# EAGLE schematic harjapiirilevy (EAGLE 9.6.2)
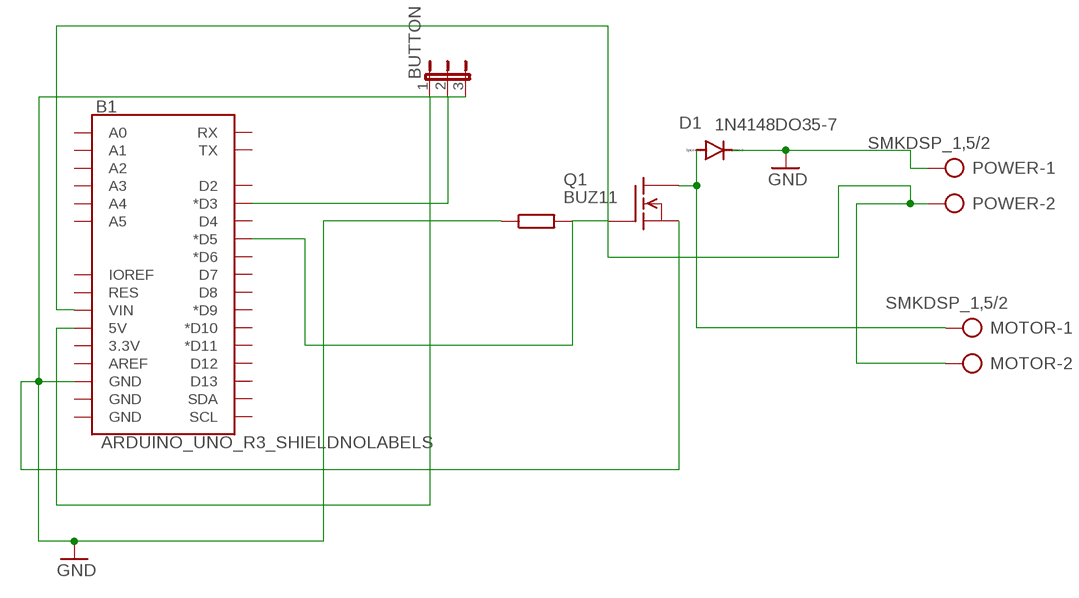
[diagram p0: schematic, sheet 1]

## Parts
B1  ARDUINO_UNO_R3_SHIELDNOLABELS  [UNO_R3_SHIELD_NOLABELS]
BUTTON  JP2E  [JP2]
D1  1N4148DO35-7  [DO35-7]
MOTOR  SMKDSP_1,5/2  [SMKDSP_1,5/2]
POWER  SMKDSP_1,5/2  [SMKDSP_1,5/2]
Q1  BUZ11  [TO220]

## Nets
GND: B1.GND@2(GND) BUTTON.3 D1.C POWER.1 Q1.3(S)
N$1: B1.5V BUTTON.1
N$2: B1.D3(*D3) BUTTON.2
N$4: B1.D5(*D5) Q1.1(G)
N$5: D1.A MOTOR.1 Q1.2(D)
N$7: B1.VIN MOTOR.2 POWER.2
Unconnected: B1.3.3V B1.A0 B1.A1 B1.A2 B1.A3 B1.A4 B1.A5 B1.AREF B1.D2 B1.D4 B1.D6(*D6) B1.D7 B1.D8 B1.D9(*D9) B1.D10(*D10) B1.D11(*D11) B1.D12 B1.D13 B1.GND@0(GND) B1.GND@1(GND) B1.IOREF B1.RES B1.RX B1.SCL B1.SDA B1.TX

## Library data of the parts
B1 = SparkFun-Boards:ARDUINO_UNO_R3_SHIELD: Arduino R3 Shield Footprint Shield form compatible with the Arduino Uno R3. SparkFun Products: MG2639 Cellular Shield <https://www.sparkfun.com/products/13120> MIDI Shield <https://www.sparkfun.com/products/12898> R3 Stackable Headers Kit <https://www.sparkfun.com/products/11417>
BUTTON = jumper:JP2E: JUMPER
D1 = diode:1N4148: DIODE high speed (Philips)
MOTOR POWER = con-phoenix-smkdsp:SMKDSP_1,5/2: Printklemme, Nennstrom: 17,5 A, Bemessungsspannung: 250 V, Raster: 5,0 mm Source: http://eshop.phoenixcontact.de .. 1733415.pdf; MF: FARNELL; MPN: 1733570; OC_FARNELL: 3041244; OC_NEWARK: 69C8588
Q1 = transistor-fet:BUZ11: N-Channel Enhancement MOSFET 50V; 30A; 0,040Ohm

## Net classes
0 default: width 1 mm, drill 1 mm, clearance 1 mm